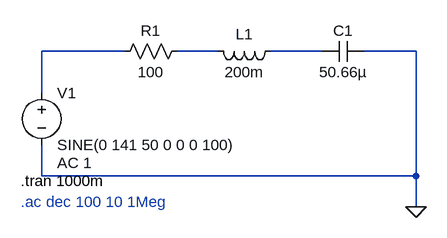
[diagram p0: schematic sample.asc]
sample.asc, the LTspice schematic file:
Version 4
SHEET 1 880 680
WIRE 144 80 16 80
WIRE 288 80 224 80
WIRE 448 80 368 80
WIRE 592 80 512 80
WIRE 16 144 16 80
WIRE 16 272 16 224
WIRE 592 272 592 80
WIRE 592 272 16 272
WIRE 592 320 592 272
FLAG 592 320 0
SYMBOL voltage 16 128 R0
WINDOW 123 24 124 Left 2
WINDOW 39 0 0 Left 0
SYMATTR Value2 AC 1
SYMATTR InstName V1
SYMATTR Value SINE(0 141 50 0 0 0 100)
SYMBOL res 240 64 R90
WINDOW 0 0 56 VBottom 2
WINDOW 3 32 56 VTop 2
SYMATTR InstName R1
SYMATTR Value 100
SYMBOL ind 384 64 R90
WINDOW 0 5 56 VBottom 2
WINDOW 3 32 56 VTop 2
SYMATTR InstName L1
SYMATTR Value 200m
SYMBOL cap 512 64 R90
WINDOW 0 0 32 VBottom 2
WINDOW 3 32 32 VTop 2
SYMATTR InstName C1
SYMATTR Value 50.66µ
TEXT -16 280 Left 2 !.tran 1000m
TEXT -16 312 Left 2 ;.ac dec 100 10 1Meg

The netlist it stands for:
* sample.asc
V1 N001 0 SINE(0 141 50 0 0 0 100) AC 1
R1 N002 N001 100
L1 N003 N002 200m
C1 0 N003 50.66µ
.tran 1000m
* .ac dec 100 10 1Meg
.backanno
.end